# Altium schematic sheet PowerSupply.SchDoc
size A4; Author: Esteban Durán Madrid; CompanyName: Universidad de Santiago de Chile; Address1: Avenida Ecuador Nº 3519; Address2: Estación Central, Santiago; Address3: Chile; DocumentNumber: 2; SheetNumber: 2; SheetTotal: 4
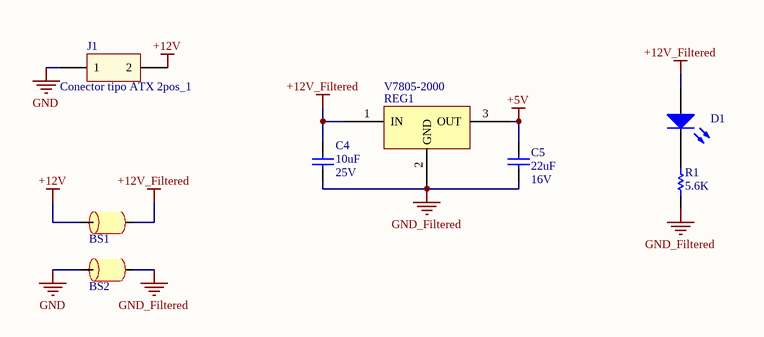
[diagram p0: PowerSupply.SchDoc]

## Parts
BS1  Ferrite bead  [RES_1206]  (value not drawn)
BS2  Ferrite bead  [RES_1206]  (value not drawn)
C4  10uF  Voltage: 25V  [CAP_0603]
C5  22uF  Voltage: 16V  [CAP_0805]
D1  LED  [LED_0805_GREEN]  (value not drawn)
J1  Conector tipo ATX 2pos_1  [Conector tipo ATX Wurth 2 posiciones - (5.5mm)]
R1  5.6K  [RES_0805]
REG1  V7805-2000  [REG_SW 5V]

## Nets
+5V: C5.1 REG1.3(OUT)
+12V: BS1.1 J1.2
+12V_Filtered: BS1.2 C4.1 D1.1(A) REG1.1(IN)
GND: BS2.1 J1.1
GND_Filtered: BS2.2 C4.2 C5.2 R1.1 REG1.2(GND)
NetD1_2: D1.2(K) R1.2

## Notes on the sheet
- Title
- Size:
- Date:
- A4
- Revision:
- Time:
- Sheet
- of
- Author:
- Project:

## Library data of the parts
BS1 BS2 = Bead: 4A; Manufacturer Part-Number: FBMJ3216HM600-T; Digikey Part-Number: 587-1770-1-ND
C4 = Cap_0603: Capacitor Ceramic; Manufacturer Part-Number: ZRB18AR61E106ME01L; Digikey Part-Number: 490-10991-1-ND; Value: 10uF
C5 = Cap_0805: Capacitor; Manufacturer Part-Number: CL21A226MOCLRNC; Digikey Part-Number: 1276-6780-1-ND; Value: 22uF
D1 = LED2: LED Magenta; Manufacturer Part-Number: LTST-C171GKT; Published: 8-Jun-2000; LatestRevisionDate: 17-Jul-2002; LatestRevisionNote: Re-released for DXP Platform.; PackageDocument: Feb-2002; PackageReference: 3.2X1.6X1.1; Publisher: Altium Limited; Digikey Part-Number: 160-1423-1-ND
J1 = Conector tipo ATX 2pos_1: CONN HEADER VERT 2POS 5.5MM; Manufacturer Part-Number: 64900221122; Digikey Part-Number: 732-1927-ND
R1 = Res0805: Manufacturer Part-Number: ERJ-P06J562V; Published: 8-Jun-2000; LatestRevisionDate: 17-Jul-2002; LatestRevisionNote: Re-released for DXP Platform.; PackageReference: AXIAL-0.3; Publisher: Altium Limited; PackageDescription: Axial Device, Thru-Hole; 2 Leads; 0.3 in Pin Spacing; Digikey Part-Number: P5.6KADCT-ND; Value: 5.6K
REG1 = V78XX: DC/DC Converter; Manufacturer Part-Number: V7805-2000R; Digikey Part-Number: 102-2188-ND